# Altium schematic sheet Amplifier.SchDoc
size A4; SheetNumber: 4; SheetTotal: 4
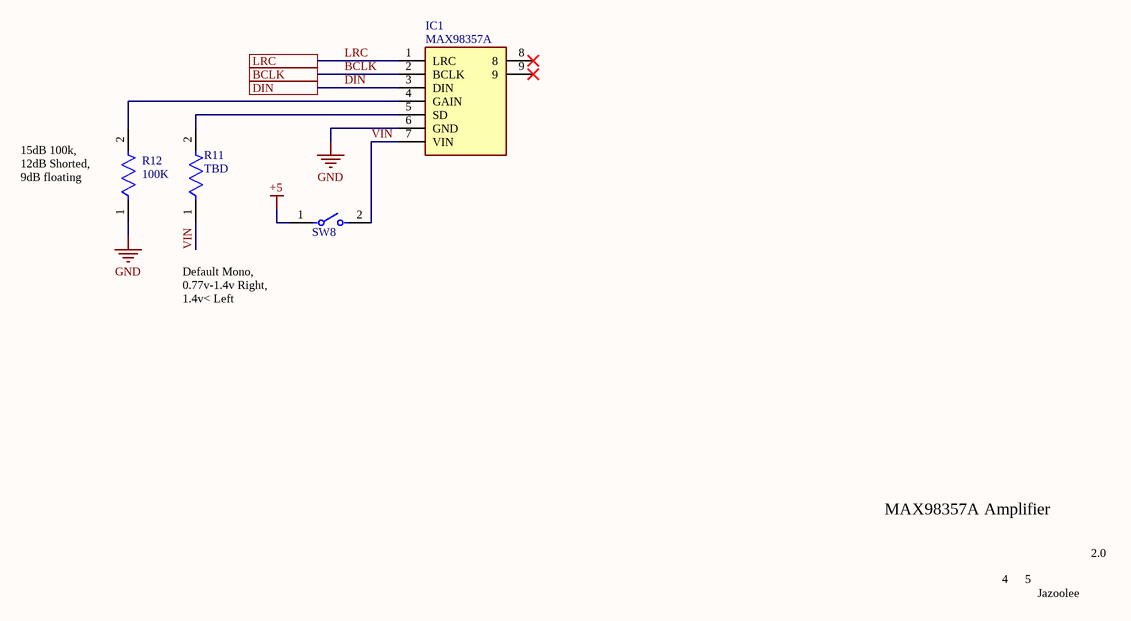
[diagram p0: Amplifier.SchDoc]

## Parts
IC1  MAX98357A  [3006]
R11  TBD  [FP-MRS25-MFG]
R12  Resistance: 100K  [FP-ERA6A-IPC_B]  (hidden comment: ERA-6AEB104V)
SW8  BD01  [FP-BD01-MFG]  (value not drawn)

## Ports
BCLK (see Main[7A]), DIN (see Main[7A]), LRC (see Main[7A])

## Nets
+5: SW8.1
GND: IC1.6(GND) R12.1
BCLK: IC1.2(BCLK) ; port BCLK
DIN: IC1.3(DIN) ; port DIN
LRC: IC1.1(LRC) ; port LRC
VIN: IC1.7(VIN) R11.1 SW8.2
NetIC1_4: IC1.4(GAIN) R12.2
NetIC1_5: IC1.5(SD) R11.2

Not connected (* = marked no-connect by the designer): IC1 8* 9*

## Notes on the sheet
- (near R12) 15dB 100k, 12dB Shorted, 9dB floating
- Default Mono, 0.77v-1.4v Right, 1.4v< Left
- MAX98357A Amplifier
- 4
- 5
- 2.0
- Jazoolee

## Library data of the parts
IC1 = 3006: Integrated Circuit; Manufacturer_Name: Adafruit; Datasheet Link: https://cdn-learn.adafruit.com/downloads/pdf/adafruit-max98357-i2s-class-d-mono-amp.pdf; Height: 3mm; Manufacturer_Part_Number: 3006; Mouser Part Number: 485-3006; Mouser Price/Stock: https://www.mouser.co.uk/ProductDetail/Adafruit/3006?qs=SV%252B0z0o3NTtodS8r%2Ftqo5A%3D%3D; Arrow Part Number: 3006; Arrow Price/Stock: https://www.arrow.com/en/products/3006/adafruit-industries
R11 = CMP-00030-42757237-1: MRS25000C1000FRP00 Resistor, 100 Ohm, ± 1%, 600 mW, Axial Leaded, Metal Film (Thin Film), Professional; Max Power Dissipation: 600mW; Resistance: 100Ω; Voltage Rating: 350V; Temperature Coefficient: 50ppm/°C; Lead Diameter: 600µm; RoHS: Compliant; Radiation Hardening: No; Schedule B: 8533210090, 8533210090; Length: 6.5mm; Packaging: Tape & Reel (TR); Number of Terminations: 2; Mount: Through Hole; Width: 2.5mm; Tolerance: 1%; Military Standard: Not; Voltage Rating (DC): 350V; Contact Plating: Tin; Number of Pins: 2; Max Operating Temperature: 155°C; NexarPartId: 42757237; Diameter: 2.5mm; Composition: Metal Film, Thin Film; REACH SVHC: Unknown; Power Rating: 600mW; Lead Free: Lead Free; Termination: Axial; Case/Package: Axial; Min Operating Temperature: -55°C
R12 = CMP-2001-00583-2: RES 100K OHM 0.1% 1/8W 0805; Max Power Dissipation: 125mW; Voltage Rating: 100V; Temperature Coefficient: 25ppm/°C; Resistance Tolerance: 0.1%; Resistor Type: Thin Film; Mount: Surface Mount; Package Quantity: 1; RoHS Compliant: Yes; Features: Automotive AEC-Q200; Termination: Solder; Contact Plating: Tin; Number of Pins: 2; Construction: Rectangular; Size Code: 0805; Case/Package: 0805; Military Standard: Not; Voltage Rating (DC): 100V; Max Operating Temperature: 155°C; REACH SVHC: No SVHC; Series: ERA-6A; Case Code (Metric): 2012; Number of Terminations: 2; Tolerance: 0.1%; Width: 1.25mm; Depth: 1.25mm; Lead Free: Lead Free; Radiation Hardening: No; Length: 2mm; Technology: METAL FILM; Power Rating: 125mW; Min Operating Temperature: -55°C; Height: 0.5mm; Case Code (Imperial): 0805; Packaging: Tape and Reel
SW8 = CMP-10033-000004-1: SWITCH SLIDE DIP SPST 100MA 5V; Max Voltage Rating (DC): 25V; Contact Current Rating: 25mA; Pitch: 0.1inch; Number of Circuits: 1; Actuator Material: Nylon; Life (Cycles): 10000Cycles; Body Material: PBT; Approvals: UL; Actuator Type: Slide (Standard); Washable: Yes; Actuator Length: 0.9mm; Capacitance: 5pF; Length: 0.18inch; Lead Free: Lead Free; Material: Nylon; Termination: PC Pin; Orientation: Straight; Throw Configuration: SPST; Case/Package: DIP; Package Quantity: 115; Packaging: Rail/Tube; Number of Positions: 1; Max Operating Temperature: 85°C; Terminal Pitch: 2.54mm; Mount: Through Hole; Min Operating Temperature: -40°C; RoHS Compliant: Yes; Depth: 9.65mm; Electrical Life: 10000Cycles; Series: BD; Contact Material: Bronze; Max Current Rating: 100mA; Current Rating: 100mA; Mechanical Life: 10000Cycles; Number of Poles: 1; REACH SVHC: No SVHC; Contact Plating: Gold; Radiation Hardening: No; Width: 9.65mm; Voltage Rating (DC): 5V